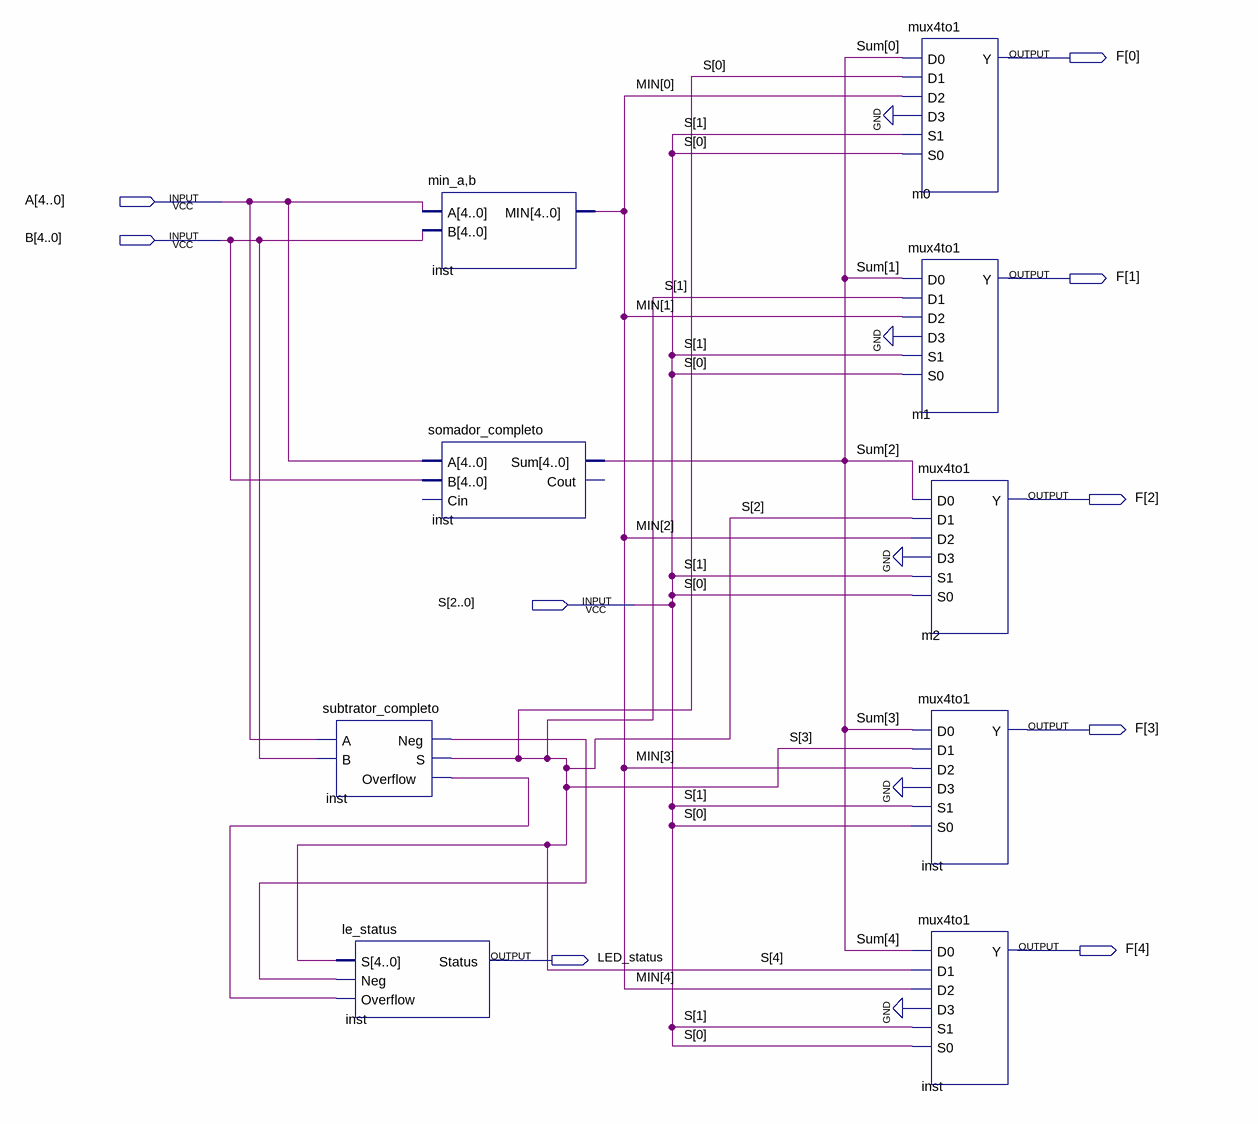
[diagram p0: schematic sheet]
// Quartus schematic ula.bdf as structural Verilog: 9 symbols, 9 pins
module ula (
  input  [4:0] A,
  input  [4:0] B,
  input  [2:0] S,
  output [4:0] F,
  output LED_status
);

  wire inst_neg, inst_overflow, undriven, undriven_2;
  wire [4:4] MIN, Sum;

  subtrator_completo inst (.A(undriven), .B(undriven_2), .Neg(inst_neg), .S(S[2]), .Overflow(inst_overflow));
  le_status inst_dup2 (.S({5{S[2]}}), .Neg(inst_neg), .Overflow(inst_overflow));  // open: Status
  \min_a,b  inst_dup3 (.A({5{undriven}}), .B({5{undriven_2}}), .MIN(MIN[4]));
  somador_completo inst_dup4 (.A({5{undriven}}), .B({5{undriven_2}}), .Sum(Sum[4]));  // open: Cin, Cout
  mux4to1 m0 (.D0(Sum[4]), .D1(S[2]), .D2(MIN[4]), .D3(1'b0), .S1(S[2]), .S0(S[2]));  // open: Y
  mux4to1 m1 (.D0(Sum[4]), .D1(S[2]), .D2(MIN[4]), .D3(1'b0), .S1(S[2]), .S0(S[2]));  // open: Y
  mux4to1 m2 (.D0(Sum[4]), .D1(S[2]), .D2(MIN[4]), .D3(1'b0), .S1(S[2]), .S0(S[2]), .Y(F[2]));
  mux4to1 inst_dup5 (.D0(Sum[4]), .D1(S[2]), .D2(MIN[4]), .D3(1'b0), .S1(S[2]), .S0(S[2]), .Y(F[3]));
  mux4to1 inst_dup6 (.D0(Sum[4]), .D1(S[2]), .D2(MIN[4]), .D3(1'b0), .S1(S[2]), .S0(S[2]));  // open: Y

  assign S[1:0] = {2{S[2]}};

  // Other names for the same wires on the sheet: MIN[3:0] = {4{MIN[4]}}; S[4:3] = {2{S[2]}}; Sum[3:0] = {4{Sum[4]}}
endmodule
